# Altium schematic sheet WiFi_Interface.SchDoc
size A4; DrawnBy: Hanif; DocumentNumber: 5; SheetNumber: 5; SheetTotal: 8
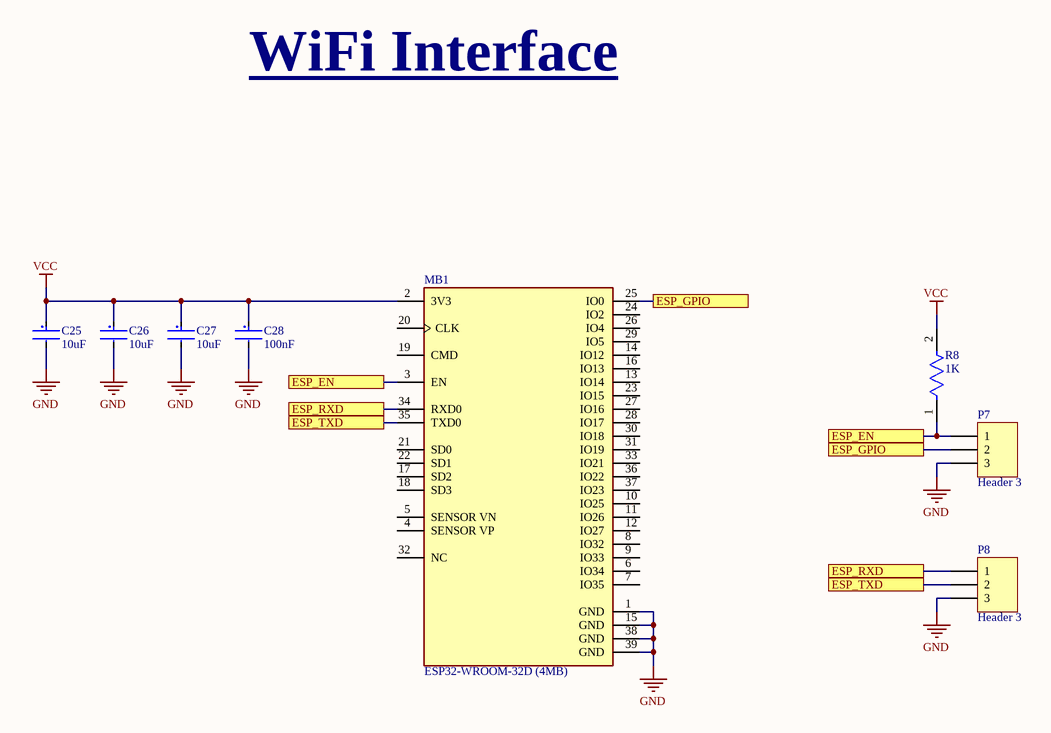
[diagram p0: WiFi_Interface.SchDoc]

## Parts
C25  10uF  [Samsung_CL31_IPC_A_1206]
C26  10uF  [Samsung_CL31_IPC_A_1206]
C27  10uF  [Samsung_CL31_IPC_A_1206]
C28  100nF  [Samsung_CL31_IPC_A_1206]
MB1  ESP32-WROOM-32D (4MB)  [Espressif_Systems_0_MFG]
P7  Header 3  [HDR1X3]
P8  Header 3  [HDR1X3]
R8  1K  [YAGEO_RC1206-0_65_IPC_A]

## Ports
ESP_EN, ESP_GPIO, ESP_RXD, ESP_TXD

## Nets
GND: C25.2 C26.2 C27.2 C28.2 MB1.1(GND) MB1.15(GND) MB1.38(GND) MB1.39(GND) P7.3 P8.3
VCC: C25.1 C26.1 C27.1 C28.1 MB1.2(3V3) R8.2
ESP_EN: MB1.3(EN) P7.1 R8.1 ; port ESP_EN
ESP_GPIO: MB1.25(IO0) P7.2 ; port ESP_GPIO
ESP_RXD: MB1.34(RXD0) P8.1 ; port ESP_RXD
ESP_TXD: MB1.35(TXD0) P8.2 ; port ESP_TXD

Not connected (* = marked no-connect by the designer): MB1 4(SENSOR_VP) 5(SENSOR_VN) 6(IO34) 7(IO35) 8(IO32) 9(IO33) 10(IO25) 11(IO26) 12(IO27) 13(IO14) 14(IO12) 16(IO13) 17(SD2) 18(SD3) 19(CMD) 20(CLK) 21(SD0) 22(SD1) 23(IO15) 24(IO2) 26(IO4) 27(IO16) 28(IO17) 29(IO5) 30(IO18) 31(IO19) 32(NC) 33(IO21) 36(IO22) 37(IO23)

## Notes on the sheet
- WiFi Interface
- Project Name:
- Size:
- Date:
- A4
- Doc Num:
- Time:
- Version:
- Sheet
- of
- File:
- Drawn by:

## Library data of the parts
C25-C27 = CL31A106KQHNNWE: CAP CER 10UF 6.3V X5R 1206, ±10% 6.3V Ceramic Capacitor X5R 1206 (3216 Metric); Supplier 1: Digi-Key; Supplier Part Number 1: 1276-3043-1-ND
C28 = CL31B104KBCNFNC: CAP CER 0.1UF 50V X7R 1206, ±10% 50V Ceramic Capacitor X7R 1206 (3216 Metric); Supplier 1: Digi-Key; Supplier Part Number 1: 1276-2744-1-ND
MB1 = ESP32-WROOM-32D(4MBHIGHTEMP): Bluetooth, WiFi 802.11b/g/n, Bluetooth v4.2 +EDR, Class 1, 2 and 3 Transceiver Module 2.4GHz ~ 2.5GHz Integrated, Trace Surface Mount; Manufacturer: Espressif Systems; Manufacturer Part Number: ESP32-WROOM-32D(4MBHIGHTEMP); RoHS: No; Supplier 1: DigiKey; Supplier 2: Digi-Key; Supplier Part Number 1: 1965-ESP32-WROOM-32D(4MBHIGHTEMP)DKR-ND
P7 P8 = Header 3: Header, 3-Pin; LatestRevisionDate: 17-Jul-2002; LatestRevisionNote: Re-released for DXP Platform.; Publisher: Altium Limited
R8 = RC1206JR-071KL: 1 ±5% 0.25W, 1/4W Chip Resistor 1206 (3216 Metric) Moisture Resistant Thick Film; Supplier 1: Digi-Key; Supplier Part Number 1: 311-1.0KERCT-ND